# EAGLE design pre2 (EAGLE 5.10)
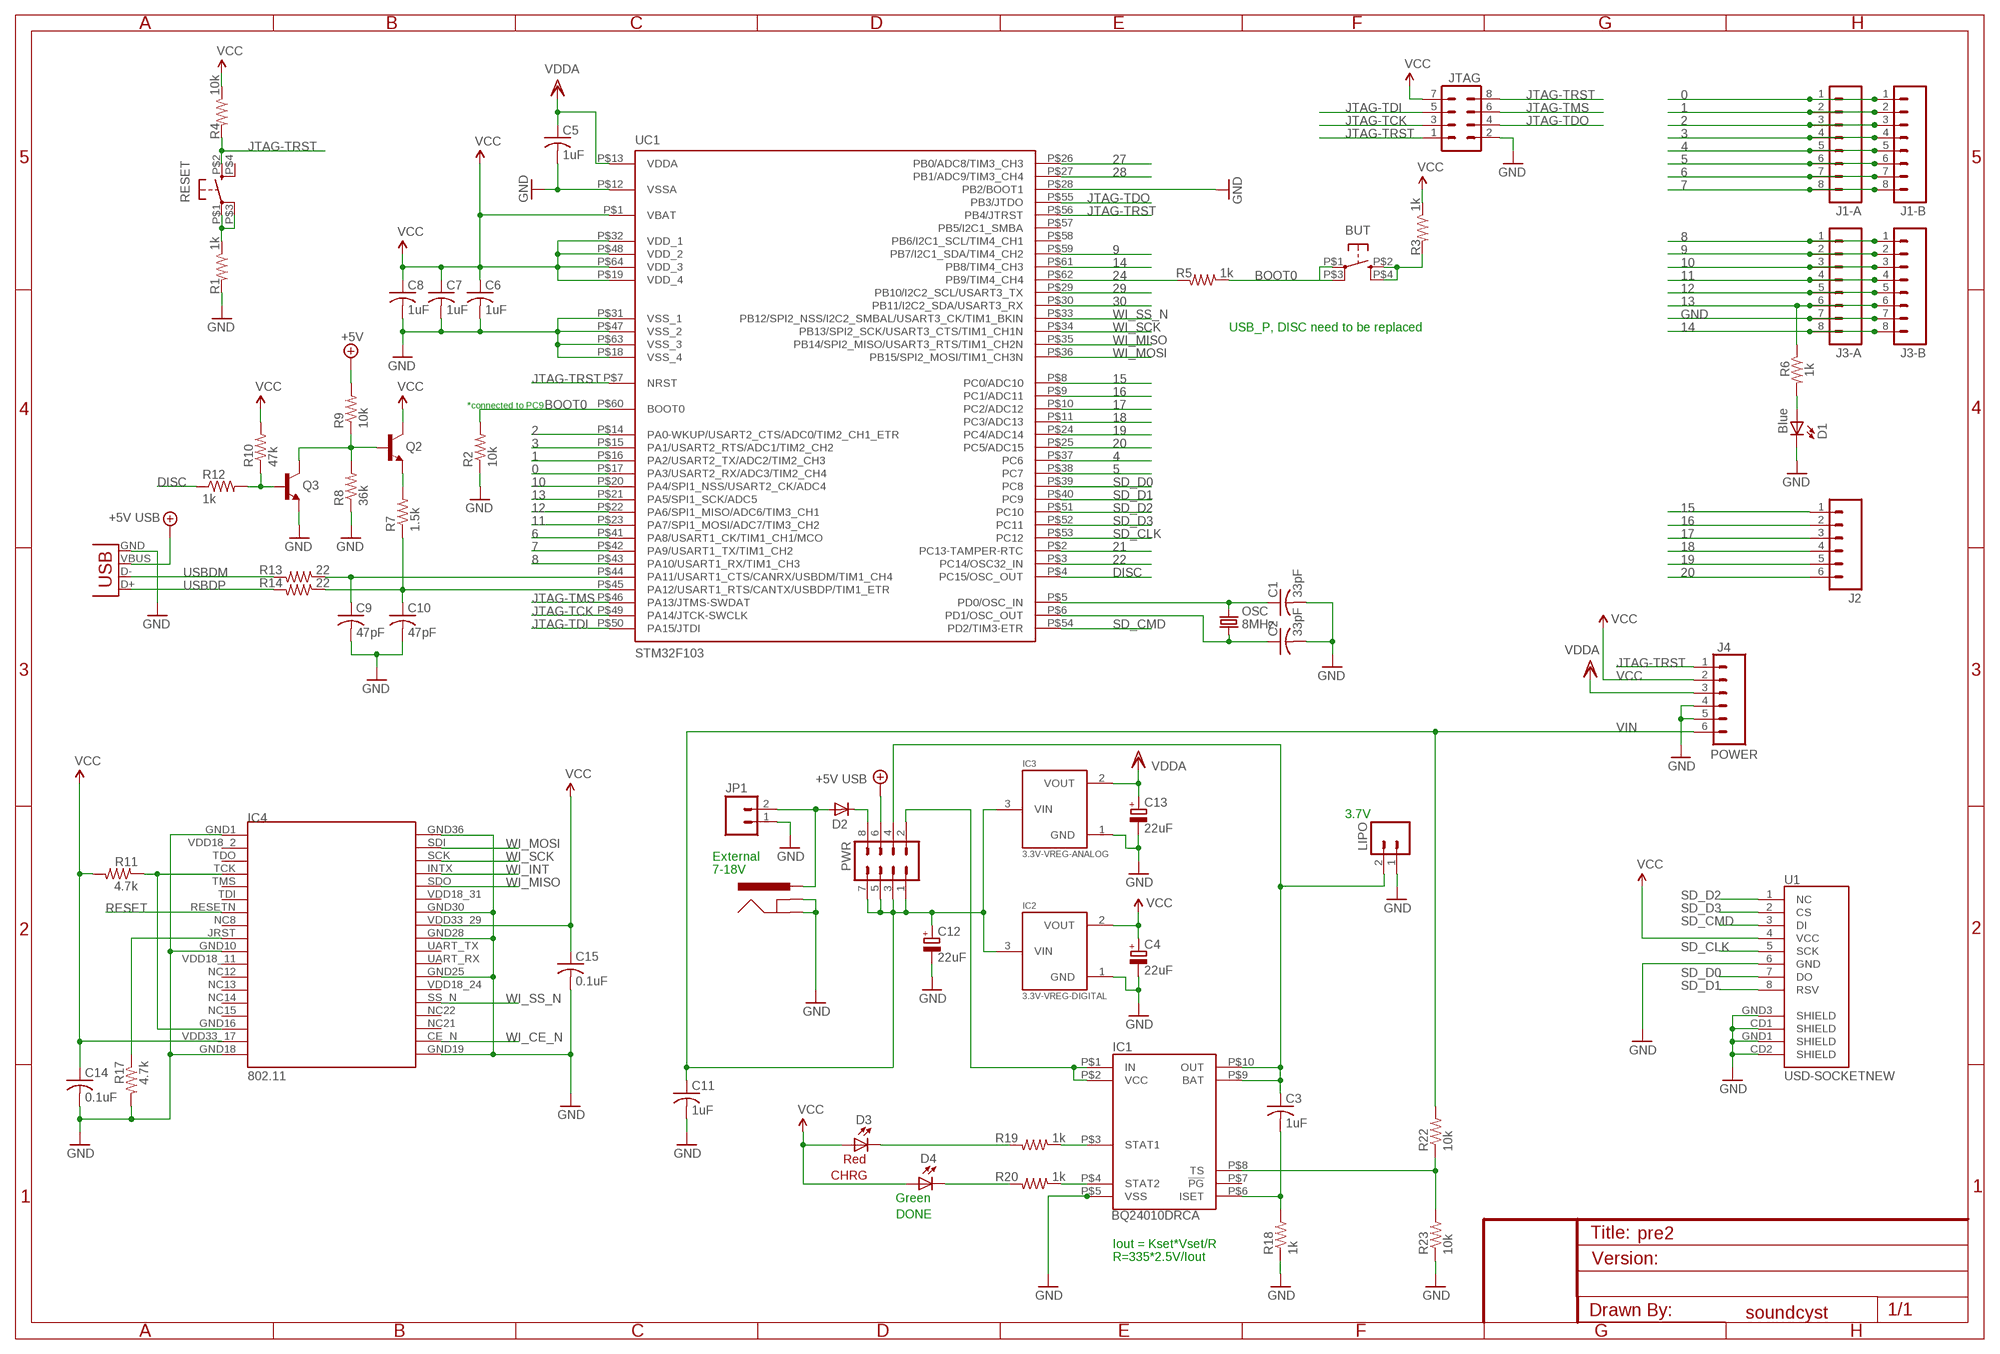
[diagram p0: schematic, sheet 1]

## Parts
BAR  POWER_JACKPTH  [POWER_JACK_PTH]
BUT  BUTTON-KMR241GLFS  [PUSHBUTTON-KMR241GLFS]
C1  33pF  C  [C0603]
C2  33pF  C  [C0603]
C3  1uF  C  [C0603]
C4  22uF  CPOL-EUUD-4X5,8  [UD-4X5,8_NICHICON]
C5  1uF  C  [C0603]
C6  1uF  C  [C0603]
C7  1uF  C  [C0603]
C8  1uF  C  [C0603]
C9  47pF  C  [C0603]
C10  47pF  C  [C0603]
C11  1uF  C  [C0603]
C12  22uF  CPOL-EUUD-4X5,8  [UD-4X5,8_NICHICON]
C13  22uF  CPOL-EUUD-4X5,8  [UD-4X5,8_NICHICON]
C14  0.1uF  C  [C0603]
C15  0.1uF  C  [C0603]
D1  Blue  LED0603  [LED-0603]
D2  DIODE-SOD323-W  [SOD323-W]
D3  Red  LED0603  [LED-0603]
D4  Green  LED0603  [LED-0603]
IC1  BQ24010DRCA  [PSON10-V2]
IC2  3.3V-VREG-DIGITAL  MCP1700T  [SOT23]
IC3  3.3V-VREG-ANALOG  MCP1700T  [SOT23]
IC4  802.11  ZG2100MOD  [ZG2100MOD]
J1-A  M08  [1X08]
J1-B  MA08-SQUARE  [1X08-SQUARE]
J2  M06SIP  [1X06]
J3-A  M08  [1X08]
J3-B  MA08-SQUARE  [1X08-SQUARE]
J4  POWER  M06SIP  [1X06]
JP1  M02PTH  [1X02]
JTAG  MA04-2  [MA04-2]
LIPO  LiPo  M02-JST-2MM-SMT  [S2B-PH]
OSC  8MHz  CRYSTAL5X3  [CRYSTAL-SMD-5X3]
PWR  MA04-2  [MA04-2]
Q2  TRANSISTOR_NPNSOT23  [SOT23]
Q3  TRANSISTOR_NPNSOT23  [SOT23]
R1  1k  R  [R0603]
R2  10k  R  [R0603]
R3  1k  R  [R0603]
R4  10k  R  [R0603]
R5  1k  R  [R0603]
R6  1k  R  [R0603]
R7  1.5k  R  [R0603]
R8  36k  R  [R0603]
R9  10k  R  [R0603]
R10  47k  R  [R0603]
R11  4.7k  R  [R0603]
R12  1k  R  [R0603]
R13  22  R  [R0603]
R14  22  R  [R0603]
R17  4.7k  R  [R0603]
R18  1k  R  [R0603]
R19  1k  R  [R0603]
R20  1k  R  [R0603]
R22  10k  R  [R0603]
R23  10k  R  [R0603]
RESET  BUTTON-KMR241GLFS  [PUSHBUTTON-KMR241GLFS]
U1  USD-SOCKETNEW  [MICRO-SD-SOCKET-PP]
UC1  STM32F103  [TQFP-10X10-64]
X1  USBSMD  [USB-MINIB]

## Nets
0: J1-A.1 J1-B.1 UC1.P$17(PA3/USART2_RX/ADC3/TIM2_CH4)
1: J1-A.2 J1-B.2 UC1.P$16(PA2/USART2_TX/ADC2/TIM2_CH3)
2: J1-A.3 J1-B.3 UC1.P$14(PA0-WKUP/USART2_CTS/ADC0/TIM2_CH1_ETR)
3: J1-A.4 J1-B.4 UC1.P$15(PA1/USART2_RTS/ADC1/TIM2_CH2)
4: J1-A.5 J1-B.5 UC1.P$37(PC6)
5: J1-A.6 J1-B.6 UC1.P$38(PC7)
6: J1-A.7 J1-B.7 UC1.P$41(PA8/USART1_CK/TIM1_CH1/MCO)
7: J1-A.8 J1-B.8 UC1.P$42(PA9/USART1_TX/TIM1_CH2)
8: J3-A.1 J3-B.1 UC1.P$43(PA10/USART1_RX/TIM1_CH3)
9: J3-A.2 J3-B.2 UC1.P$59(PB7/I2C1_SDA/TIM4_CH2)
10: J3-A.3 J3-B.3 UC1.P$20(PA4/SPI1_NSS/USART2_CK/ADC4)
11: J3-A.4 J3-B.4 UC1.P$23(PA7/SPI1_MOSI/ADC7/TIM3_CH2)
12: J3-A.5 J3-B.5 UC1.P$22(PA6/SPI1_MISO/ADC6/TIM3_CH1)
13: J3-A.6 J3-B.6 R6.1 UC1.P$21(PA5/SPI1_SCK/ADC5)
14: J3-A.8 J3-B.8 UC1.P$61(PB8/TIM4_CH3)
15: J2.1 UC1.P$8(PC0/ADC10)
16: J2.2 UC1.P$9(PC1/ADC11)
17: J2.3 UC1.P$10(PC2/ADC12)
18: J2.4 UC1.P$11(PC3/ADC13)
19: J2.5 UC1.P$24(PC4/ADC14)
20: J2.6 UC1.P$25(PC5/ADC15)
21: UC1.P$2(PC13-TAMPER-RTC)
22: UC1.P$3(PC14/OSC32_IN)
24: R5.2 UC1.P$62(PB9/TIM4_CH4)
27: UC1.P$26(PB0/ADC8/TIM3_CH3)
28: UC1.P$27(PB1/ADC9/TIM3_CH4)
29: UC1.P$29(PB10/I2C2_SCL/USART3_TX)
30: UC1.P$30(PB11/I2C2_SDA/USART3_RX)
+5V: PWR.6 R9.2 X1.VBUS ; supply symbol labelled +5V USB
BOOT0: BUT.P$1 BUT.P$3 R2.2 R5.1 UC1.P$60(BOOT0)
DISC: R12.1 UC1.P$4(PC15/OSC_OUT)
GND [vcc]: BAR.GND BAR.GNDBREAK C1.2 C2.2 C4.- C5.2 C6.2 C7.2 C8.2 C9.2 C10.2 C11.2 C12.- C13.- C14.2 C15.2 D1.C IC1.P$5(VSS) IC2.1(GND) IC3.1(GND) IC4.GND1 IC4.GND10 IC4.GND18 IC4.GND19 IC4.GND25 IC4.GND28 IC4.GND30 IC4.GND36 J3-A.7 J3-B.7 J4.4 J4.5 JP1.1 JTAG.2 LIPO.1 Q3.2(E) R1.2 R2.1 R8.1 R17.2 R18.1 R23.1 U1.6(GND) U1.CD1(SHIELD) U1.CD2(SHIELD) U1.GND1(SHIELD) U1.GND3(SHIELD) UC1.P$12(VSSA) UC1.P$18(VSS_4) UC1.P$28(PB2/BOOT1) UC1.P$31(VSS_1) UC1.P$47(VSS_2) UC1.P$63(VSS_3) X1.GND
JTAG-TCK: JTAG.3 UC1.P$49(PA14/JTCK-SWCLK)
JTAG-TDI: JTAG.5 UC1.P$50(PA15/JTDI)
JTAG-TDO: JTAG.4 UC1.P$55(PB3/JTDO)
JTAG-TMS: JTAG.6 UC1.P$46(PA13/JTMS-SWDAT)
JTAG-TRST: J4.1 JTAG.1 JTAG.8 R4.2 RESET.P$2 UC1.P$7(NRST) UC1.P$56(PB4/JTRST)
N$1 [vcc]: BAR.PWR D2.A JP1.2
N$2: C2.1 OSC.1 UC1.P$6(PD1/OSC_OUT)
N$3: IC1.P$8(TS) R22.1 R23.2
N$5: D2.C PWR.8
N$6: C1.1 OSC.3 UC1.P$5(PD0/OSC_IN)
N$7: D1.A R6.2
N$8: Q2.2(E) R7.2
N$9: Q2.1(B) Q3.3(C) R8.2 R9.1
N$10: Q3.1(B) R10.1 R12.2
N$11: C9.1 R13.1 UC1.P$44(PA11/USART1_CTS/CANRX/USBDM/TIM1_CH4)
N$12: C10.1 R7.1 R14.1 UC1.P$45(PA12/USART1_RTS/CANTX/USBDP/TIM1_ETR)
N$13: IC1.P$1(IN) IC1.P$2(VCC) PWR.2
N$16 [vcc]: C3.1 IC1.P$9(BAT) IC1.P$10(OUT) LIPO.2 PWR.4
N$18: IC4.GND16 IC4.TCK R11.1
N$19: C3.2 IC1.P$6(ISET) R18.2
N$20: D4.C R20.2
N$21: D3.C R19.2
N$22: IC1.P$3(STAT1) R19.1
N$23: IC1.P$4(STAT2) R20.1
N$25 [vcc]: R1.1 RESET.P$1 RESET.P$3
N$26: BUT.P$2 BUT.P$4 R3.2
N$27: IC4.JRST R17.1
RESET: IC4.RESETN(RSTN)
SD_CLK: U1.5(SCK) UC1.P$53(PC12)
SD_CMD: U1.3(DI) UC1.P$54(PD2/TIM3-ETR)
SD_D0: U1.7(DO) UC1.P$39(PC8)
SD_D1: U1.8(RSV) UC1.P$40(PC9)
SD_D2: U1.1(NC) UC1.P$51(PC10)
SD_D3: U1.2(CS) UC1.P$52(PC11)
USBDM: R13.2 X1.D-
USBDP: R14.2 X1.D+
VCC: C4.+ C6.1 C7.1 C8.1 C14.1 C15.1 D3.A D4.A IC2.2(VOUT) IC4.VDD33_17 IC4.VDD33_29 J4.2 JTAG.7 Q2.3(C) R3.1 R4.1 R10.2 R11.2 U1.4(VCC) UC1.P$1(VBAT) UC1.P$19(VDD_4) UC1.P$32(VDD_1) UC1.P$48(VDD_2) UC1.P$64(VDD_3)
VDD: C5.1 C13.+ IC3.2(VOUT) J4.3 UC1.P$13(VDDA) ; supply symbol labelled VDDA
VIN: C11.1 C12.+ IC2.3(VIN) IC3.3(VIN) J4.6 PWR.1 PWR.3 PWR.5 PWR.7 R22.2
WI_CE_N: IC4.CE_N
WI_INT: IC4.INTX
WI_MISO: IC4.SDO UC1.P$35(PB14/SPI2_MISO/USART3_RTS/TIM1_CH2N)
WI_MOSI: IC4.SDI UC1.P$36(PB15/SPI2_MOSI/TIM1_CH3N)
WI_SCK: IC4.SCK UC1.P$34(PB13/SPI2_SCK/USART3_CTS/TIM1_CH1N)
WI_SS_N: IC4.SS_N UC1.P$33(PB12/SPI2_NSS/I2C2_SMBAL/USART3_CK/TIM1_BKIN)
Unconnected: IC1.P$7(!PG) IC4.NC8 IC4.NC12 IC4.NC13 IC4.NC14 IC4.NC15 IC4.NC21 IC4.NC22 IC4.TDI IC4.TDO IC4.TMS IC4.UART_RX IC4.UART_TX IC4.VDD18_2 IC4.VDD18_11 IC4.VDD18_24 IC4.VDD18_31 RESET.P$4 UC1.P$57(PB5/I2C1_SMBA) UC1.P$58(PB6/I2C1_SCL/TIM4_CH1)

## Notes on the sheet
- USB_P, DISC need to be replaced
- *connected to PC9
- 3.7V
- External
- 7-18V
- CHRG
- DONE
- Iout = Kset*Vset/R
- R=335*2.5V/Iout
- soundcyst

## Library data of the parts
BAR = SparkFun2:POWER_JACK: Power Jack This is the standard 5.5mm barrel jack for power. The PTH is the most common, proven, reliable, footprint. All others are experimental. The Slot footprint only works if the mill layer is transmitted to the PCB fab house so be warned. Spark Fun Electronics SKU : PRT-00119. Mating wall wart : TOL-00298 (and others)
BUT RESET = okie:BUTTON-KMR241GLFS
C1-C3 C5-C11 C14 C15 = ReplenishComponentLib:C
C4 C12 C13 = rcl:CPOL-EU: POLARIZED CAPACITOR, European symbol
D1 D3 D4 = SparkFun:LED: LEDs Standard schematic elements and footprints for 5mm, 3mm, 1206, and 0603 sized LEDs. 5mm - Spark Fun Electronics SKU : COM-00529 (and others)
D2 = diode:DIODE-: DIODE
IC1 = xkn_lib:BQ24010DRC
IC2 IC3 = okie:MCP1700T
IC4 = ZGLIB:ZG2100MOD: ZG2100 Module
J1-A J3-A = SparkFun:M08: Header 8 Standard 8-pin 0.1" header. Use with straight break away headers (SKU : PRT-00116), right angle break away headers (PRT-00553), swiss pins (PRT-00743), machine pins (PRT-00117), and female headers (PRT-00115).
J1-B J3-B = SparkFun2:MA08-SQUARE
J2 J4 = SparkFun:M06: Header 6 Standard 6-pin 0.1" header. Use with straight break away headers (SKU : PRT-00116), right angle break away headers (PRT-00553), swiss pins (PRT-00743), machine pins (PRT-00117), and female headers (PRT-00115). Molex polarized connector foot print use with SKU : PRT-08094 with associated crimp pins and housings.
JP1 = SparkFun2:M02: Header 2 Standard 2-pin 0.1" header. Use with straight break away headers (SKU : PRT-00116), right angle break away headers (PRT-00553), swiss pins (PRT-00743), machine pins (PRT-00117), and female headers (PRT-00115). Molex polarized connector foot print use with SKU : PRT-08233 with associated crimp pins and housings.
JTAG PWR = con-lstb:MA04-2: PIN HEADER
LIPO = SparkFun:M02: Header 2 Standard 2-pin 0.1" header. Use with straight break away headers (SKU : PRT-00116), right angle break away headers (PRT-00553), swiss pins (PRT-00743), machine pins (PRT-00117), and female headers (PRT-00115). Molex polarized connector foot print use with SKU : PRT-08233 with associated crimp pins and housings.
OSC = SparkFun2:CRYSTAL: Crystals Various standard crystals. Proven footprints. Spark Fun Electronics SKU : COM-00534
Q2 Q3 = SparkFun2:TRANSISTOR_NPN: Transistor NPN BJT configuration in SOT23 package. MMBT2222 is the common NPN we use. Double check BCE configuration again layout.
R1-R14 R17-R20 R22 R23 = ReplenishComponentLib:R
U1 = SparkFun:USD-SOCKET: microSD Socket Push-push type uSD socket. Schematic element and footprint production proven. Spark Fun Electronics SKU : PRT-00127. tDoc lines correctly indicate media card edge positions when inserting (unlocked, locked, depressed).
UC1 = st-microelectronics:STM32F103
X1 = SparkFun2:USB: USB Connectors USB-B-PTH is fully proven SKU : PRT-00139 USB-miniB is fully proven SKU : PRT-00587 USB-A-PCB is untested. USB-A-H is throughly reviewed, but untested. Spark Fun Electronics SKU : PRT-00437 USB-B-SMT is throughly reviewed, but untested. Needs silkscreen touching up. USB-A-S has not been used/tested USB-MB-H has not been used/tested

## Net classes
0 default: width 0.203 mm, clearance 0.152 mm
1 vcc: width 0.254 mm, clearance 0.152 mm
2 gnd: width 0.305 mm, drill 0.508 mm, clearance 0.152 mm
3 usbvcc: width 0.508 mm, drill 0.508 mm, clearance 0.152 mm

## Board
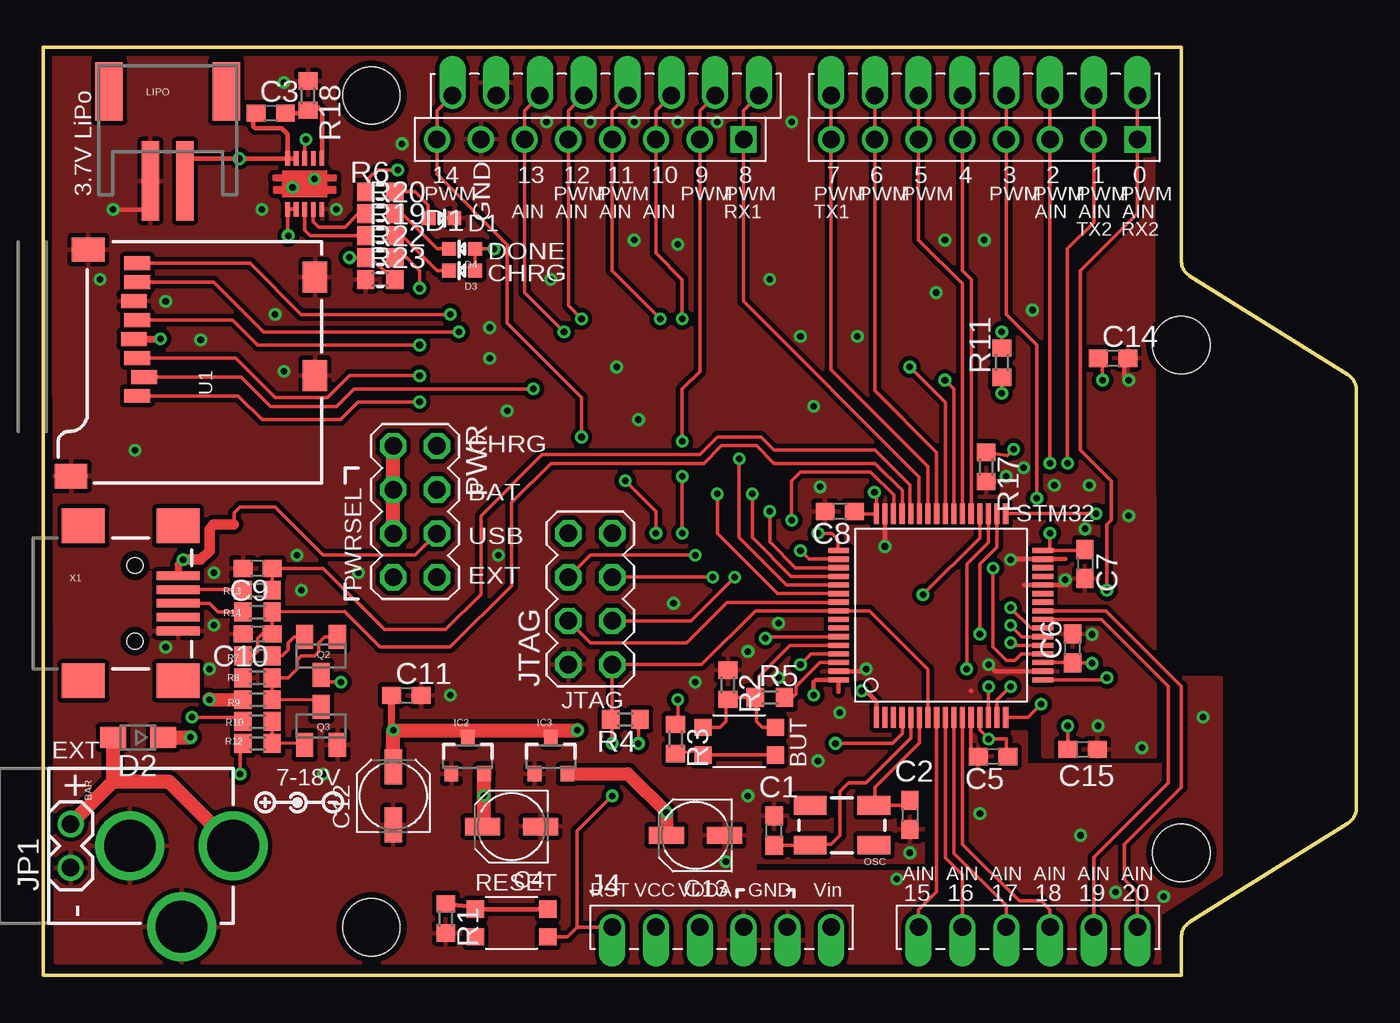
[diagram p1: board, top side]
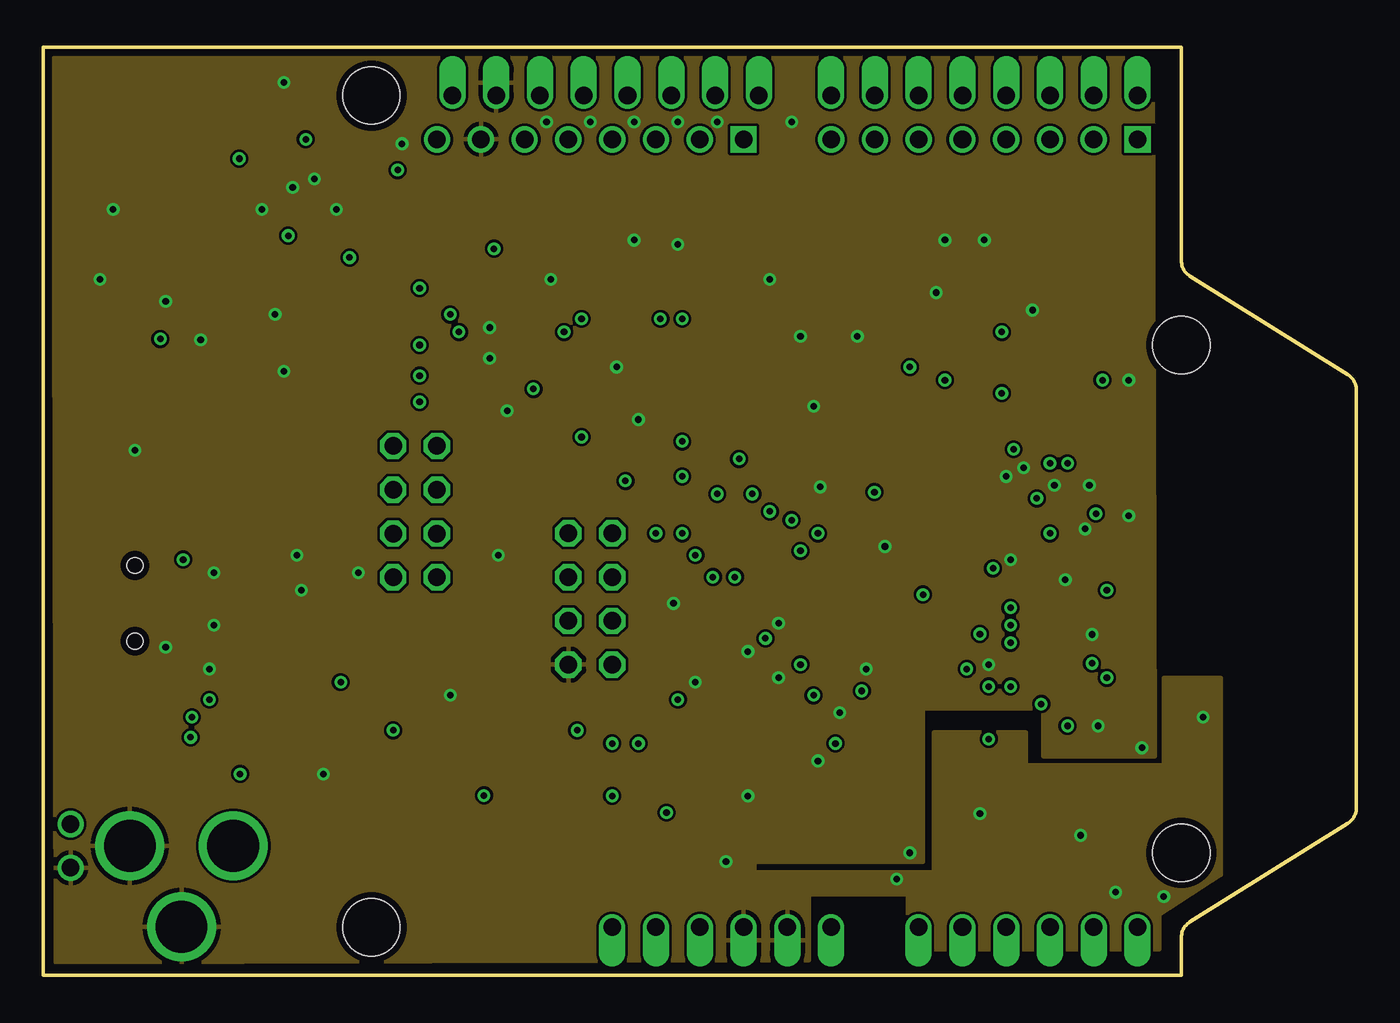
[diagram p2: board, inner layer gndplane]
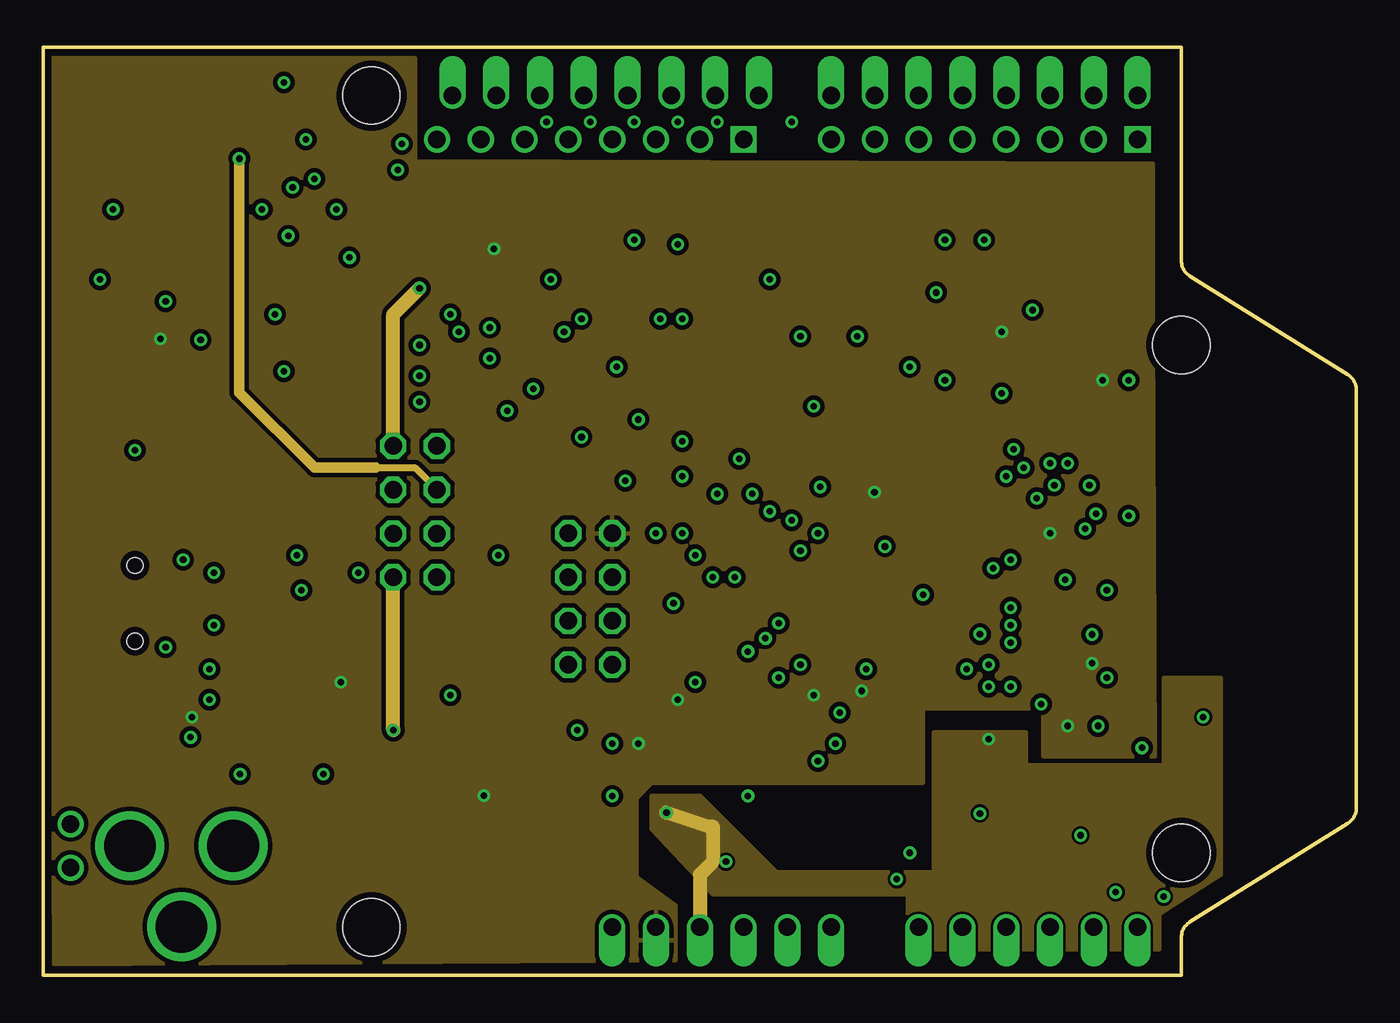
[diagram p3: board, inner layer Route15]
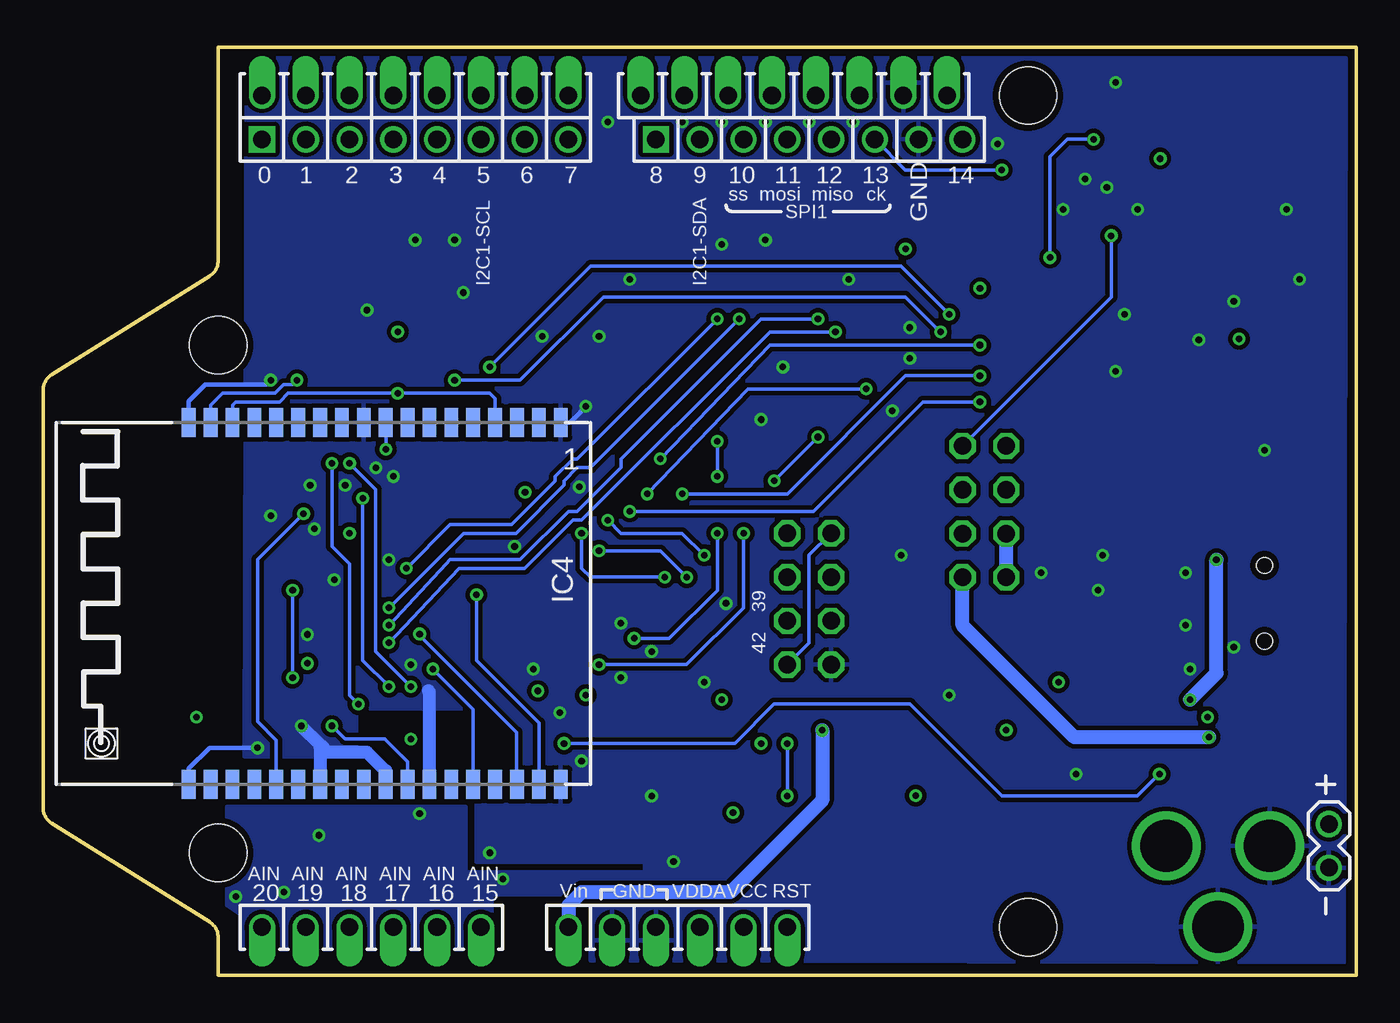
[diagram p4: board, bottom side, seen from below]

Size 76.2 x 53.85 mm. Coordinates in mm from the lower left corner, seen from the top.
Outline: 75.69,8.83 arc58 76.2,9.74 76.2,33.95 arc58 75.69,34.86 66.55,40.58 arc-58 66.04,41.49 66.04,53.85 0,53.85 0,0 66.04,0 66.04,2.2 arc-58 66.55,3.11 75.69,8.83
Copper layers (1*16): Top 0.0356mm / dielectric 1.5011mm / Bottom 0.0356mm
Design rules "LaenPCBOrder": minimum track width 6mil, minimum drill 13mil, track to track 6mil, track to pad 6mil, pad to pad 6mil, via to via 6mil, smd to smd 6mil, copper to edge 15mil, drill to drill 6mil, minimum pad ring 7mil, minimum via ring 7mil, stop-mask expansion 4mil, vias tented up to drill 0mil, thermal gap 10mil

### Footprints (pad centres in the part's own frame; a part is rotated, then mirrored left to right if it is on the bottom)
POWER_JACK_PTH = drill 2.997 round: GND 0,7.7; GNDBREAK 4.7,10.7; PWR 0,13.7
PUSHBUTTON-KMR241GLFS = smd 1 x 1: P$1 2.1,0.8; P$2 2.1,-0.8; P$3 -2.1,0.8; P$4 -2.1,-0.8
C0603 = smd 1.1 x 1: 1 -0.85,0; 2 0.85,0
UD-4X5,8_NICHICON = smd 2.032 x 1: + 1.679,0; - -1.679,0
LED-0603 = smd 0.8 x 0.8: A 0,-0.75; C 0,0.75
SOD323-W = smd 1.5 x 1.2: A 1.45,0; C -1.45,0
PSON10-V2 = smd 0.85 x 0.28: P$1 -1.475,1; P$2 -1.475,0.5; P$3 -1.475,0; P$4 -1.475,-0.5; P$5 -1.475,-1; P$6 1.475,-1; P$7 1.475,-0.5; P$8 1.475,0; P$9 1.475,0.5; P$10 1.475,1
SOT23 = smd 0.8 x 0.9: 1 -0.95,-1; 2 0.95,-1; 3 0,1.1
ZG2100MOD = smd 0.8 x 1.7: CE_N 6.63,10.12; GND1 -13.69,-10.88; GND10 -2.26,-10.88; GND16 5.36,-10.88; GND18 7.9,-10.88; GND19 7.9,10.12; GND25 0.28,10.12; GND28 -3.53,10.12; GND30 -6.07,10.12; GND36 -13.69,10.12; INTX -9.88,10.12; JRST -3.53,-10.88; NC8 -4.8,-10.88; NC12 0.28,-10.88; NC13 1.55,-10.88; NC14 2.82,-10.88; NC15 4.09,-10.88; NC21 5.36,10.12; NC22 4.09,10.12; RESETN -6.07,-10.88; SCK -11.15,10.12; SDI -12.42,10.12; SDO -8.61,10.12; SS_N 2.82,10.12; TCK -9.88,-10.88; TDI -7.34,-10.88; TDO -11.15,-10.88; TMS -8.61,-10.88; UART_RX -0.99,10.12; UART_TX -2.26,10.12; VDD18_2 -12.42,-10.88; VDD18_11 -0.99,-10.88; VDD18_24 1.55,10.12; VDD18_31 -7.34,10.12; VDD33_17 6.63,-10.88; VDD33_29 -4.8,10.12
1X08 = drill 1.016 offset: 1 0,0; 2 2.54,0; 3 5.08,0; 4 7.62,0; 5 10.16,0; 6 12.7,0; 7 15.24,0; 8 17.78,0
1X08-SQUARE = drill 1.016 square: 1 -8.89,0 | drill 1.016 round: 2 -6.35,0; 3 -3.81,0; 4 -1.27,0; 5 1.27,0; 6 3.81,0; 7 6.35,0; 8 8.89,0
1X06 = drill 1.016 offset: 1 0,0; 2 2.54,0; 3 5.08,0; 4 7.62,0; 5 10.16,0; 6 12.7,0
1X02 = drill 1.016 round: 1 0,0; 2 2.54,0
MA04-2 = drill 1.016 octagon: 1 -3.81,-1.27; 2 -3.81,1.27; 3 -1.27,-1.27; 4 -1.27,1.27; 5 1.27,-1.27; 6 1.27,1.27; 7 3.81,-1.27; 8 3.81,1.27
S2B-PH = smd 1 x 4.6: 1 -1,-3.7; 2 1,-3.7 | smd 1.6 x 3.4: NC1 -3.4,1.5; NC2 3.4,1.5
CRYSTAL-SMD-5X3 = smd 1.9 x 1.1: 1 -1.85,-1.15; 2 1.85,-1.15; 3 1.85,1.15; 4 -1.85,1.15
SOT23' = smd 1 x 1.4: 1 -0.95,-1.1; 2 0.95,-1.1; 3 0,1.1
R0603 = smd 1 x 1.1: 1 -0.85,0; 2 0.85,0
MICRO-SD-SOCKET-PP = smd 0.8 x 1.5: 1 -8.94,10.7; 2 -7.84,10.3; 3 -6.74,10.7; 4 -5.64,10.9; 5 -4.54,10.7; 6 -3.44,10.9; 7 -2.34,10.7; 8 -1.24,10.7 | smd 1.8 x 1.4: CD1 -2.05,0.4; CD2 -7.75,0.4 | smd 1.4 x 1.9: GND1 -13.6,14.55; GND3 -0.45,13.55
STAND-OFF = hole 3.302: 0,0
TQFP-10X10-64 = smd 1.2 x 0.3: P$1 -5.936,3.75; P$2 -5.936,3.25; P$3 -5.936,2.75; P$4 -5.936,2.25; P$5 -5.936,1.75; P$6 -5.936,1.25; P$7 -5.936,0.75; P$8 -5.936,0.25; P$9 -5.936,-0.25; P$10 -5.936,-0.75; P$11 -5.936,-1.25; P$12 -5.936,-1.75; P$13 -5.936,-2.25; P$14 -5.936,-2.75; P$15 -5.936,-3.25; P$16 -5.936,-3.75; P$33 5.886,-3.75; P$34 5.886,-3.25; P$35 5.886,-2.75; P$36 5.886,-2.25; P$37 5.886,-1.75; P$38 5.886,-1.25; P$39 5.886,-0.75; P$40 5.886,-0.25; P$41 5.886,0.25; P$42 5.886,0.75; P$43 5.886,1.25; P$44 5.886,1.75; P$45 5.886,2.25; P$46 5.886,2.75; P$47 5.886,3.25; P$48 5.886,3.75 | smd 0.3 x 1.2: P$17 -3.75,-5.911; P$18 -3.25,-5.911; P$19 -2.75,-5.911; P$20 -2.25,-5.911; P$21 -1.75,-5.911; P$22 -1.25,-5.911; P$23 -0.75,-5.911; P$24 -0.25,-5.911; P$25 0.25,-5.911; P$26 0.75,-5.911; P$27 1.25,-5.911; P$28 1.75,-5.911; P$29 2.25,-5.911; P$30 2.75,-5.911; P$31 3.25,-5.911; P$32 3.75,-5.911; P$49 3.75,5.936; P$50 3.25,5.936; P$51 2.75,5.936; P$52 2.25,5.936; P$53 1.75,5.936; P$54 1.25,5.936; P$55 0.75,5.936; P$56 0.25,5.936; P$57 -0.25,5.936; P$58 -0.75,5.936; P$59 -1.25,5.936; P$60 -1.75,5.936; P$61 -2.25,5.936; P$62 -2.75,5.936; P$63 -3.25,5.936; P$64 -3.75,5.936
USB-MINIB = smd 2.5 x 0.5: D+ 2.5,0; D- 2.5,0.8; GND 2.5,-1.6; ID 2.5,-0.8; VBUS 2.5,1.6 | smd 2.5 x 2: GND@1 -3,-4.5; GND@2 -3,4.5; GND@3 2.5,4.5; GND@4 2.5,-4.5 | hole 0.9: 0,2.2; 0,-2.2

### Placement (x,y rotation side)
BAR  -2.67,7.52 270 top
BUT  40.39,13.59 0 top
C1  42.42,8.41 90 top
C2  50.29,9.32 270 top
C3  13.21,50.04 0 top
C4  27.18,8.64 180 top
C5  55.12,12.7 180 top
C6  59.74,18.97 90 top
C7  60.45,23.88 270 top
C8  46.23,26.92 180 top
C9  12.45,23.62 180 top
C10  12.45,19.81 180 top
C11  21.08,16.26 0 top
C12  20.32,10.41 90 top
C13  37.85,8.13 180 top
C14  62.08,35.81 0 top
C15  60.31,13.12 0 top
D1  23.11,43.94 270 top
D2  5.51,13.82 180 top
D3  24.31,40.89 90 top
D4  24.31,42.16 90 top
IC1  15.18,45.93 90 top
IC2  24.64,12.7 0 top
IC3  29.46,12.7 0 top
IC4  59.85,21.21 180 bottom
J1-A  63.5,51.05 180 top
J1-B  54.61,48.51 180 top
J2  50.8,2.79 0 top
J3-A  41.53,51.05 180 top
J3-B  31.75,48.51 180 top
J4  33.02,2.79 0 top
JP1  1.6,6.25 90 top
JTAG  31.75,21.84 90 top
LIPO  7.23,49.8 0 top
OSC  46.35,8.71 180 top
PWR  21.58,26.91 270 top
Q2  [SOT23']  16.13,18.54 180 top
Q3  [SOT23']  16.13,14.48 0 top
R1  23.37,3.3 270 top
R2  39.73,16.87 270 top
R3  36.7,13.72 270 top
R4  33.78,14.86 180 top
R5  42.16,16.13 0 top
R6  19.56,45.47 0 top
R7  12.45,18.54 0 top
R8  12.45,17.27 0 top
R9  12.45,16 180 top
R10  12.45,14.73 180 top
R11  55.63,35.56 90 top
R12  12.45,13.46 0 top
R13  12.45,22.35 180 top
R14  12.45,21.08 180 top
R17  54.72,29.51 270 top
R18  15.37,51.05 270 top
R19  19.56,42.93 0 top
R20  19.56,44.2 0 top
R22  19.56,41.66 0 top
R23  19.56,40.39 0 top
RESET  27.18,3.05 0 top
U1  16.17,42.57 90 top
U$1  STAND-OFF  [STAND-OFF]  19.05,2.79 0 top
U$2  STAND-OFF  [STAND-OFF]  66.04,36.58 0 top
U$4  STAND-OFF  [STAND-OFF]  19.05,51.05 0 top
U$10  STAND-OFF  [STAND-OFF]  66.04,7.11 0 top
UC1  52.1,20.9 90 top
X1  5.33,21.59 0 top

### Tracks (layer width: path | path; a pad name or v marks a point on that pad's centre or on a via)
0  (via drill 0.38)
  Top 0.203: J1-A.1 J1-B.1 63.5,44.2 60.2,40.89 60.2,30.48 61.98,28.7 61.98,26.42 61.72,26.16 v61.72,22.35 | UC1.P$17 61.6,17.15 v61.72,17.27
  Bottom 0.203: v61.72,17.27 v61.72,22.35
1  (via drill 0.38)
  Top 0.203: J1-A.2 J1-B.2 60.96,43.69 59.44,42.16 v59.44,29.72 | UC1.P$16 57.13,14.97 v57.91,15.75
  Bottom 0.203: v57.91,15.75 58.42,16.26 58.42,23.88 59.44,24.89 v59.44,29.72
2  (via drill 0.38)
  Top 0.203: J1-A.3 J1-B.3 v58.42,29.72 | v54.86,16.76 54.84,16.75 UC1.P$14
  Bottom 0.203: v54.86,16.76 56.9,18.8 56.9,28.19 v58.42,29.72
3  (via drill 0.38)
  Top 0.203: J1-A.4 J1-B.4 55.88,38.35 57.66,36.58 v57.66,27.69 | UC1.P$15 55.34,15.97 v56.13,16.76
  Bottom 0.203: v57.66,27.69 57.66,18.29 v56.13,16.76
4
  Top 0.203: J1-A.5 J1-B.5 53.34,40.89 53.85,40.39 UC1.P$37
5
  Top 0.203: J1-A.6 J1-B.6 50.8,42.67 53.34,40.13 UC1.P$38
6
  Top 0.203: J1-A.7 J1-B.7 48.26,33.93 51.84,30.35 UC1.P$41
7
  Top 0.203: J1-A.8 J1-B.8 45.72,35.15 51.33,29.54 51.33,26.8 UC1.P$42
8
  Top 0.203: J3-A.1 40.64,50.16 J3-B.1 40.64,39.12 50.83,28.93 50.83,26.81 UC1.P$43
9  (via drill 0.38)
  Top 0.203: J3-A.2 38.1,50.16 J3-B.2 38.1,35.05 37.08,34.04 v37.08,30.99 | UC1.P$59 42.01,19.65 v41.91,19.56 | v37.08,25.65 v37.08,28.96
  Bottom 0.203: v41.91,19.56 39.88,19.56 37.08,22.35 v37.08,25.65 | v37.08,28.96 v37.08,30.99
10  (via drill 0.38)
  Top 0.203: J3-A.3 35.56,50.16 J3-B.3 35.56,41.91 37.08,40.39 v37.08,38.1 | v55.12,23.62 55.12,19.05 55.88,18.29 56.39,18.29 56.75,18.65 UC1.P$20
  Bottom 0.203: v55.12,23.62 52.58,26.16 49.02,26.16 46.48,28.7 46.48,28.96 45.47,29.97 45.21,29.97 v37.08,38.1
11  (via drill 0.38)
  Top 0.203: J3-A.4 33.02,50.16 J3-B.4 33.02,40.89 v35.81,38.1 | UC1.P$23 57.32,20.15 v56.13,21.34
  Bottom 0.203: v56.13,21.34 51.82,25.65 48.77,25.65 45.97,28.45 45.97,28.7 45.21,29.46 44.45,29.46 v35.81,38.1
12  (via drill 0.38)
  Top 0.203: J3-A.5 30.48,50.16 J3-B.5 30.48,38.86 v31.24,38.1 | UC1.P$22 56.8,19.65 v56.13,20.32
  Bottom 0.203: v56.13,20.32 52.83,23.88 52.58,24.13 48.51,24.13 45.72,26.92 45.21,26.92 42.67,29.46 42.67,29.97 34.54,38.1 v31.24,38.1
13  (via drill 0.38)
  Top 0.203: J3-A.6 27.94,50.16 J3-B.6 27.94,39.62 v30.23,37.34 | v20.57,46.74 19.38,46.74 18.92,46.28 18.92,45.48 R6.1 | UC1.P$21 56.28,19.15 v56.13,19.3
  Bottom 0.203: J3-B.6 26.16,46.74 v20.57,46.74 | v56.13,19.3 52.07,23.62 48.26,23.62 45.47,26.42 44.96,26.42 34.04,37.34 v30.23,37.34
14  (via drill 0.38)
  Top 0.203: J3-A.8 22.86,50.16 J3-B.8 22.86,46.48 26.92,42.42 26.92,37.85 31.24,33.53 v31.24,31.24 | v35.56,25.65 35.56,26.92 v33.78,28.7 | UC1.P$61 44.56,18.65 v43.94,18.03
  Bottom 0.203: v35.56,25.65 35.56,21.34 38.86,18.03 v43.94,18.03 | v33.78,28.7 v31.24,31.24
15
  Top 0.203: UC1.P$8 51.84,4.86 50.8,3.81 J2.1
16
  Top 0.203: UC1.P$9 52.34,6.84 53.34,5.84 J2.2
17
  Top 0.203: UC1.P$10 52.84,7.1 55.88,4.06 J2.3
18
  Top 0.203: UC1.P$11 53.34,7.62 56.64,4.32 57.91,4.32 58.42,3.81 J2.4
19
  Top 0.203: UC1.P$24 61.39,20.65 65.28,16.76 65.28,11.18 60.96,6.86 J2.5
20
  Top 0.203: UC1.P$25 61.65,21.15 66.04,16.76 66.04,10.92 62.74,7.62 62.74,5.59 63.5,4.83 J2.6
24
  Top 0.203: UC1.P$62 45.08,18.15 43.69,16.76 43.69,16.33 43.48,16.13 R5.2
+5V  (via drill 0.38)
  Top 0.203: PWR.6 21.59,24.38 16.26,24.38 13.46,27.18 11.43,27.18 11.09,26.83 11.09,26.19 11.06,26.16 | v9.65,16 9.65,16.03
  Top 0.406: X1.VBUS 7.83,23.84 v8.13,24.13
  Top 0.61: v8.13,24.13 9.14,24.13 9.65,24.64 9.65,25.91 9.91,26.16 11.06,26.16
  Top 0.813: 9.65,16.03 R9.2
  Bottom 0.813: v9.65,16 8.13,17.53 v8.13,24.13
BOOT0
  Top 0.203: UC1.P$60 43.34,19.15 41.53,17.35 41.53,16.14 | 41.53,16.14 R5.1 41.4,16.04 41.4,14.73 41.74,14.39 BUT.P$1 | 41.53,16.14 40.3,16.14 R2.2 39.62,15.91 39.62,14.73 39.28,14.39 BUT.P$3
DISC  (via drill 0.38)
  Top 0.203: v11.43,11.68 11.43,13.3 R12.1 | UC1.P$4 49.84,14.03 49.28,13.46 v45.97,13.46
  Bottom 0.203: v11.43,11.68 12.7,10.41 20.57,10.41 25.91,15.75 33.78,15.75 36.07,13.46 v45.97,13.46
GND  (via drill 0.38)
  Top 0.203: UC1.P$47 48.84,24.97 48.77,24.89 | UC1.P$12 53.84,13.12 C5.2
  Top 0.254: UC1.P$47 48.84,25.07 v48.84,24.89 | LIPO.1 6.23,44.45 v4.06,44.45 | v62.99,34.54 62.74,34.8 62.74,35.54 | UC1.P$63 47.63,17.65 v47.75,17.78 | 53.84,16.51 53.85,16.51 | UC1.P$31 56.16,24.15 v56.13,24.13 | UC1.P$28 59.39,22.65 v59.31,22.96 | UC1.P$18 55.24,17.65 v54.86,18.03 | 56.95,22.66 57.56,22.66
  Bottom 0.254: IC4.GND18 67.75,33.34 66.8,34.29 63.25,34.29 v62.99,34.54 | IC4.GND1 45.64,32.09 v44.7,33.02 | IC4.GND19 67.75,12 66.55,13.21 v63.75,13.21
  Bottom 0.762: IC4.GND30 53.78,16.45 53.85,16.51 | IC4.GND28 56.32,11.87 57.4,12.95 59.69,12.95 60.07,13.33 | 60.07,13.33 v61.21,14.48 | IC4.GND25 60.13,13.27 60.07,13.33
  other vias: 39.62,6.6 55.88,28.96 56.9,29.46 7.11,19.05 9.65,17.78 9.91,20.32 9.91,23.37 7.11,39.12 13.97,35.05 3.3,40.39 5.33,30.48 17.02,44.45 43.94,37.08 42.16,40.39 47.24,37.08 51.82,39.62 52.32,42.67 57.4,38.61 60.71,28.45 58.67,28.45 34.29,42.67 36.83,42.42 29.46,40.39 9.14,36.88 13.46,38.35 14.73,24.38 14.99,22.35 26.42,24.38 18.29,23.37 42.67,20.45 46.23,15.24 60.45,25.91 62.99,26.67 60.86,19.79 54.36,9.4 34.54,32.26 33.27,35.31 13.97,51.82 34.29,49.53 36.83,49.53 39.12,49.53 31.75,49.53 29.21,49.53 20.83,48.26 16.26,11.68 37.85,17.02 42.67,17.27 23.62,16.26 14.48,45.72 15.75,46.23 40.89,10.41 49.53,5.59 67.31,14.99 62.23,4.83 65.02,4.57 45.09,28.35 40.89,18.8 50.29,7.11 44.96,12.45 12.7,44.45 25.91,37.59 25.91,35.81 26.92,32.77 36.58,21.59 54.61,42.67 43.43,49.53 60.2,8.13
  pour gndplane: 0.61,53.21 64.39,53.21 64.52,12.7 58.04,12.7 58.04,15.49 51.05,15.49 51.05,6.6 41.27,6.6 41.27,5.97 51.69,5.97 51.69,14.1 57.02,14.1 57.02,12.19 65.02,12.19 65.02,17.27 68.33,17.27 68.33,5.84 64.77,3.53 64.77,1.52 50.16,1.52 50.16,4.7 44.45,4.7 44.45,0.89 0.74,0.76
  pour Bottom (isolate 0.254): 0.61,53.21 64.39,53.21 64.52,12.7 58.04,12.7 58.04,15.49 51.05,15.49 51.05,6.6 41.27,6.6 41.27,5.97 51.69,5.97 51.69,9.78 65.53,9.78 65.53,4.06 64.77,3.56 64.77,1.52 50.16,1.52 50.16,4.7 44.45,4.7 44.45,0.89 0.74,0.76
  pour Top (isolate 0.254): 0.61,53.21 64.39,53.21 64.52,12.7 58.04,12.7 58.04,16 51.05,16 51.05,6.6 41.27,6.6 41.27,5.97 51.69,5.97 51.69,14.1 57.02,14.1 57.02,12.19 65.02,12.19 65.02,17.27 68.33,17.27 68.33,5.84 64.77,3.56 64.77,0.74 0.74,0.76
JTAG-TCK  (via drill 0.38)
  Top 0.203: JTAG.3 37.59,20.57 v40.13,23.11 | v44.96,25.65 45.77,25.65 46.13,25.3 46.13,24.69 UC1.P$49
  Bottom 0.203: v40.13,23.11 44.45,23.11 44.96,23.62 v44.96,25.65
JTAG-TDI  (via drill 0.38)
  Top 0.203: UC1.P$50 44.43,24.15 v43.94,24.64 | JTAG.5 v38.86,23.11
  Bottom 0.203: v43.94,24.64 40.39,24.64 v38.86,23.11
JTAG-TDO
  Top 0.203: JTAG.4 31.75,19.3 37.34,19.3 39.69,21.65 UC1.P$55
JTAG-TMS  (via drill 0.38)
  Top 0.203: JTAG.6 31.75,24.38 v37.85,24.38 | UC1.P$46 49.35,27.86 48.01,29.21 43.94,29.21 43.43,28.7 v43.43,26.42
  Bottom 0.203: v37.85,24.38 39.12,25.65 42.67,25.65 v43.43,26.42
JTAG-TRST  (via drill 0.38)
  Top 0.203: UC1.P$7 51.33,14.98 51.33,17.76 47.93,21.15 UC1.P$56 41.33,21.16 38.2,18.03 JTAG.1 33.02,14.97 R4.2 33.02,14.75 v33.02,13.46 | RESET.P$2 30.44,2.25 30.99,2.79 | 30.99,2.79 30.99,8.38 v33.02,10.41 | 30.99,2.79 J4.1
  Bottom 0.203: JTAG.8 31.75,24.38 31.75,19.3 JTAG.1 | v33.02,10.41 v33.02,13.46
N$1
  Top 0.254: D2.A
  Top 0.813: BAR.PWR 7.29,11.26 4.07,11.26 | JP1.2 4.07,11.26 | 4.07,11.26 D2.A
N$2
  Top 0.203: C2.1 49.98,9.86 OSC.1 48.26,9.92 48.26,10.92 50.84,13.51 UC1.P$6
N$3  (via drill 0.38)
  Top 0.203: R23.2 18.94,41.66 R22.1 v17.78,41.66 | IC1.P$8 15.18,48.45 v15.24,48.51
  Bottom 0.203: v15.24,48.51 16.76,48.51 17.78,47.5 v17.78,41.66
N$5  (via drill 0.38)
  Top 0.813: D2.C v8.56,13.82
  Route15 0.61: PWR.8 22.86,23.17
  Bottom 0.203: 22.86,20.32 22.85,20.32
  Bottom 0.813: v8.56,13.82 16.36,13.82 22.86,20.32 | 22.85,20.32 PWR.8
N$6
  Top 0.203: UC1.P$5 50.34,13.77 47.75,11.18 46.74,11.18 46.23,10.67 46.23,8.13 45.72,7.62 44.56,7.62 OSC.3 C1.1
N$7
  Top 0.203: R6.2 21.59,45.47 22.35,44.7 D1.A
N$8
  Top 0.203: Q2.2 14.56,19.64 14.22,19.3 14.22,18.9 13.89,18.57 R7.2
N$9
  Top 0.203: R8.2 R9.1 15.68,16.03 Q3.3 | Q2.1 16.34,19.64 16,19.3 16,18.8 15.75,18.54 14.99,18.54 14.73,18.29 14.73,17.78 14.22,17.27 R8.2 | R8.2 13.17,17.27
N$10
  Top 0.203: R10.1 R12.2 15.07,13.49 Q3.1
N$11
  Top 0.203: UC1.P$44 50.29,26.84 50.29,28.45 48.26,30.48 42.42,30.48 41.66,31.24 39.12,31.24 38.1,30.23 28.96,30.23 25.4,26.67 25.4,22.1 23.37,20.07 19.81,20.07 16.26,23.62 C9.1 R13.1
N$12
  Top 0.203: R7.1 11.88,18.57 12.22,18.57 12.45,18.8 12.45,19.56 12.7,19.81 C10.1 R14.1 17.5,21.11 19.56,19.05 23.62,19.05 27.18,22.61 27.18,27.43 29.46,29.72 38.35,29.72 39.37,30.73 41.4,30.73 42.42,29.72 48.26,29.72 49.84,28.13 UC1.P$45
N$13  (via drill 0.38)
  Top 0.203: v14.22,42.93 14.18,42.97 IC1.P$1 IC1.P$2
  Bottom 0.203: v14.22,42.93 14.22,39.35 PWR.2
N$14
  Top 0.254: 58.17,24.16 59.31,24.16
N$16  (via drill 0.38)
  Top 0.203: 12.19,49.87 C3.1
  Top 0.254: IC1.P$10 IC1.P$9 | v11.38,47.4 11.39,47.41 | 11.39,47.41 8.23,47.41 LIPO.2 | 11.39,47.41 IC1.P$10 | IC1.P$10 14.18,48.81 13.84,49.15 13.1,49.15 12.32,49.15 12.19,49.28 12.19,49.87
  Route15 0.406: 19.3,29.46 21.57,29.46 PWR.4
  Route15 0.61: v11.38,47.4 11.38,33.83 15.75,29.46 19.3,29.46
N$18  (via drill 0.38)
  Top 0.203: v55.63,33.78 R11.1
  Bottom 0.203: IC4.TCK 49.97,33.46 50.29,33.78 v55.63,33.78 61.98,33.78 62.48,33.27 65.02,33.27 65.21,33.08 IC4.GND16
N$19
  Top 0.203: R18.2 15.38,50.39 | R18.2 15.34,50.43 | 15.2,50.04 R18.2
  Top 0.254: IC1.P$6 16.18,50.16 15.95,50.39 15.38,50.39 | C3.2 15.2,50.04
N$20
  Top 0.203: R20.2 20.83,44.2 22.86,42.16 D4.C
N$21
  Top 0.203: D3.C 22.86,40.89 20.83,42.93 R19.2
N$22
  Top 0.203: IC1.P$3 15.18,43.24 15.49,42.93 R19.1
N$23
  Top 0.203: IC1.P$4 15.68,43.75 16,43.43 17.53,43.43 18.29,44.2 R20.1
N$25
  Top 0.254: RESET.P$1 RESET.P$3 25.08,3.95 R1.1
N$26
  Top 0.203: BUT.P$2 BUT.P$4 38.01,13.07 R3.2
N$27  (via drill 0.38)
  Top 0.203: R17.1 55.94,30.16 v56.31,30.53
  Bottom 0.203: v56.31,30.53 56.31,32.15 IC4.JRST
SD_CLK  (via drill 0.38)
  Top 0.203: UC1.P$53 43.13,22.65 40.39,25.4 v40.39,29.97 | U1.5 10.99,38.03 12.45,36.58 v21.84,36.58
  Bottom 0.203: v21.84,36.58 34.04,36.58 v40.39,29.97
SD_CMD  (via drill 0.38)
  Top 0.203: U1.3 11.16,35.83 13.46,33.53 16.51,33.53 17.78,34.8 v21.84,34.8 | UC1.P$54 42.62,22.15 39.12,25.65 v39.12,27.94
  Bottom 0.203: v21.84,34.8 26.16,34.8 33.02,27.94 v39.12,27.94
SD_D0  (via drill 0.38)
  Top 0.203: UC1.P$39 52.84,34.02 v52.32,34.54 | U1.7 4.97,40.23 9.91,40.23 12.8,37.34 v24.13,37.34
  Bottom 0.203: v52.32,34.54 48.51,34.54 43.69,39.37 26.16,39.37 v24.13,37.34
SD_D1  (via drill 0.38)
  Top 0.203: UC1.P$40 52.34,33.25 v50.29,35.31 | U1.8 12.01,41.33 14.99,38.35 v23.62,38.35
  Bottom 0.203: v23.62,38.35 26.42,41.15 44.45,41.15 v50.29,35.31
SD_D2  (via drill 0.38)
  Top 0.203: U1.1 11.33,33.63 12.7,32.26 17.27,32.26 18.29,33.27 v21.84,33.27 | UC1.P$51 43.66,23.65 42.16,25.15 v42.16,26.92
  Bottom 0.203: v21.84,33.27 25.15,33.27 31.5,26.92 v42.16,26.92
SD_D3  (via drill 0.38)
  Top 0.203: U1.2 11.5,34.73 13.21,33.02 17.02,33.02 18.03,34.04 v28.45,34.04 | UC1.P$52 43.39,23.15 41.15,25.4 v41.15,27.94
  Bottom 0.203: v28.45,34.04 35.31,34.04 v41.15,27.94
USBDM
  Top 0.203: X1.D- 11.83,22.39 R13.2
USBDP
  Top 0.203: X1.D+ 9.65,21.59 10.16,21.08 R14.2
VCC  (via drill 0.38)
  Top 0.203: v8.64,14.99 11.62,14.99 R10.2 | v17.27,17.02 16.55,17.02 Q2.3 | D3.A D4.A v26.16,42.16 | v48.23,28.04 48.34,27.93 UC1.P$48 47.21,26.79 C8.1 | R11.2 v55.63,37.34 | v58.42,25.65 58.42,24.65 UC1.P$32 60.38,24.65 C7.1 | v34.54,13.46 34.54,14.75 R4.1 | v36.83,16 36.83,14.49 R3.1 | UC1.P$19 59.71,18.15 C6.1 60.84,18.12 v60.86,18.11 | C15.1 59.46,14.46 v59.44,14.48 | v61.47,34.54 61.47,35.57 C14.1
  Top 0.254: v44.7,16.26 44.7,17.02 44.84,17.15 UC1.P$64 46.16,16.46 | 47.39,16.4 v47.5,16.51 47.75,16.51 48.36,15.9 48.36,14.98 UC1.P$1
  Top 0.406: U1.4 v6.81,36.93
  Top 0.813: 25.59,8.72 C4.+ 25.58,8.64 v25.58,10.44 25.58,11.7 IC2.2
  Bottom 0.203: IC4.VDD33_17 66.48,33.08 65.79,33.78 62.74,33.78 62.23,34.29 61.72,34.29 v61.47,34.54 | IC4.VDD33_29 55.05,12.38 56.39,13.72 58.67,13.72 v59.44,14.48
  pour Route15 (isolate 0.254): 35.31,11.18 51.05,11.18 51.05,15.49 58.04,15.49 58.04,12.7 64.52,12.7 64.39,37.72 64.39,47.12 21.59,47.24 21.59,53.21 0.38,53.21 0.64,0.64 36.7,0.89 36.7,4.06 34.42,5.71 34.42,10.29
VDD  (via drill 0.38)
  Top 0.203: UC1.P$13 54.34,14.23 v54.86,13.72 55.88,13.72 55.88,12.7 C5.1
  Top 0.762: 36.68,8.13 C13.+ v36.17,9.45 33.92,11.7 IC3.2
  Route15 0.813: J4.3 38.1,5.84 38.86,6.6 38.86,8.64 38.61,8.64 v36.17,9.45
  pour Route15: 38.1,10.41 35.31,10.41 35.31,8.51 38.86,4.7 50.16,4.7 50.16,1.52 64.77,1.52 64.77,3.56 68.33,5.84 68.33,17.27 65.02,17.27 65.02,12.19 57.02,12.19 57.02,14.1 51.69,14.1 51.69,5.97 42.55,5.97
VIN  (via drill 0.38)
  Top 0.203: R22.2 21.08,41.66 21.84,40.89 v21.84,39.88
  Top 0.406: C11.1 20.23,14.31 v20.31,14.23
  Top 0.813: PWR.1 PWR.3 PWR.5 | C12.+ v20.31,14.23 24.64,14.23 | 24.64,14.23 29.46,14.23 | 29.46,14.23 IC3.3 | 24.64,14.23 IC2.3 | v30.99,14.22 v30.98,14.23 29.46,14.23
  Route15 0.813: PWR.1 20.31,38.35 v21.84,39.88 | PWR.7 v20.31,14.23 v20.32,14.22
  Bottom 0.813: PWR.7 PWR.5 | J4.6 45.72,4.06 44.96,4.83 36.32,4.83 30.99,10.16 v30.99,14.22
WI_MISO  (via drill 0.38)
  Top 0.203: UC1.P$35 54.84,25.13 53.59,23.88 v53.59,17.78
  Bottom 0.203: IC4.SDO 51.24,15.43 v53.59,17.78
WI_MOSI  (via drill 0.38)
  Top 0.203: UC1.P$36 54.34,25.39 v51.05,22.1
  Bottom 0.203: v51.05,22.1 51.05,18.29 47.42,14.66 47.42,11.17 IC4.SDI
WI_SCK  (via drill 0.38)
  Top 0.203: UC1.P$34 55.34,24.87 54.36,23.88 v54.36,19.81
  Bottom 0.203: v54.36,19.81 54.36,19.74 48.72,14.1 48.72,11.17 IC4.SCK
WI_SS_N  (via drill 0.38)
  Top 0.203: v61.09,26.8 UC1.P$33
  Bottom 0.203: IC4.SS_N 62.67,13.65 63.75,14.73 63.75,24.13 v61.09,26.8

### Text on the board
tPlace: 14 | GND | 13 | 12 | 11 | 10 | 9 | 8 | 7 | 6 | 5 | 4 | 3 | 2 | 1 | 0 | 3.7V LiPo | PWM | PWM | PWM | PWM | PWM | PWM | PWM | PWM | PWM | PWM | PWM | PWM | AIN | AIN | AIN | AIN | RX1 | TX1 | AIN | AIN | AIN | D1 | TX2 | RX2 | DONE | CHRG | CHRG | PWRSEL | BAT | STM32 | USB | EXT | JTAG | EXT | 7-18V | + | AIN | AIN | AIN | AIN | AIN | AIN | RST | VCC | VDDA | GND | Vin | 15 | 16 | 17 | 18 | 19 | 20 | -
bPlace: GND | 14 | 13 | 12 | 11 | 10 | 9 | 8 | 7 | 6 | 5 | 4 | 3 | 3 | 2 | 1 | 0 | ck | miso | mosi | ss | SPI1 | I2C1-SDA | I2C1-SCL | 39 | 42 | RST | VCC | VDDA | GND | Vin | 15 | AIN | 16 | AIN | 17 | AIN | 18 | AIN | 19 | AIN | 20 | AIN
tValues: DNP | DNP | JST-Right Angle | DNP | DNP | DNP | DNP